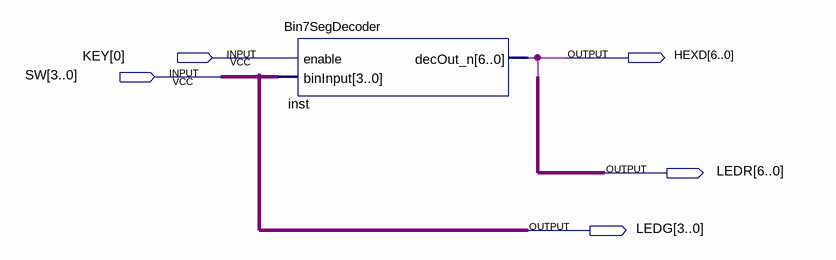
[diagram p0: schematic sheet]
// Quartus schematic DisplayDemo.bdf as structural Verilog: 1 symbols, 5 pins
module DisplayDemo (
  input  [0:0] KEY,
  input  [3:0] SW,
  output [6:0] HEXD,
  output [6:0] LEDR,
  output [3:0] LEDG
);

  wire inst_decout_n;

  Bin7SegDecoder inst (.enable(KEY[0]), .binInput(SW), .decOut_n(inst_decout_n));

  assign LEDG = SW;
endmodule
